# EasyEDA Pro project USBHUB.epro

# Schematic USBUHB2.0
Board Name: Board1; Create Date: 2025-05-13; Page Name: P1; Project Name: expertlearning-2; Schematic Name: USBUHB2.0; Update Date: 2025-05-14; Company: 东北林业大学; Drawed: runb0t; Page Size: A4; Version: V1.0
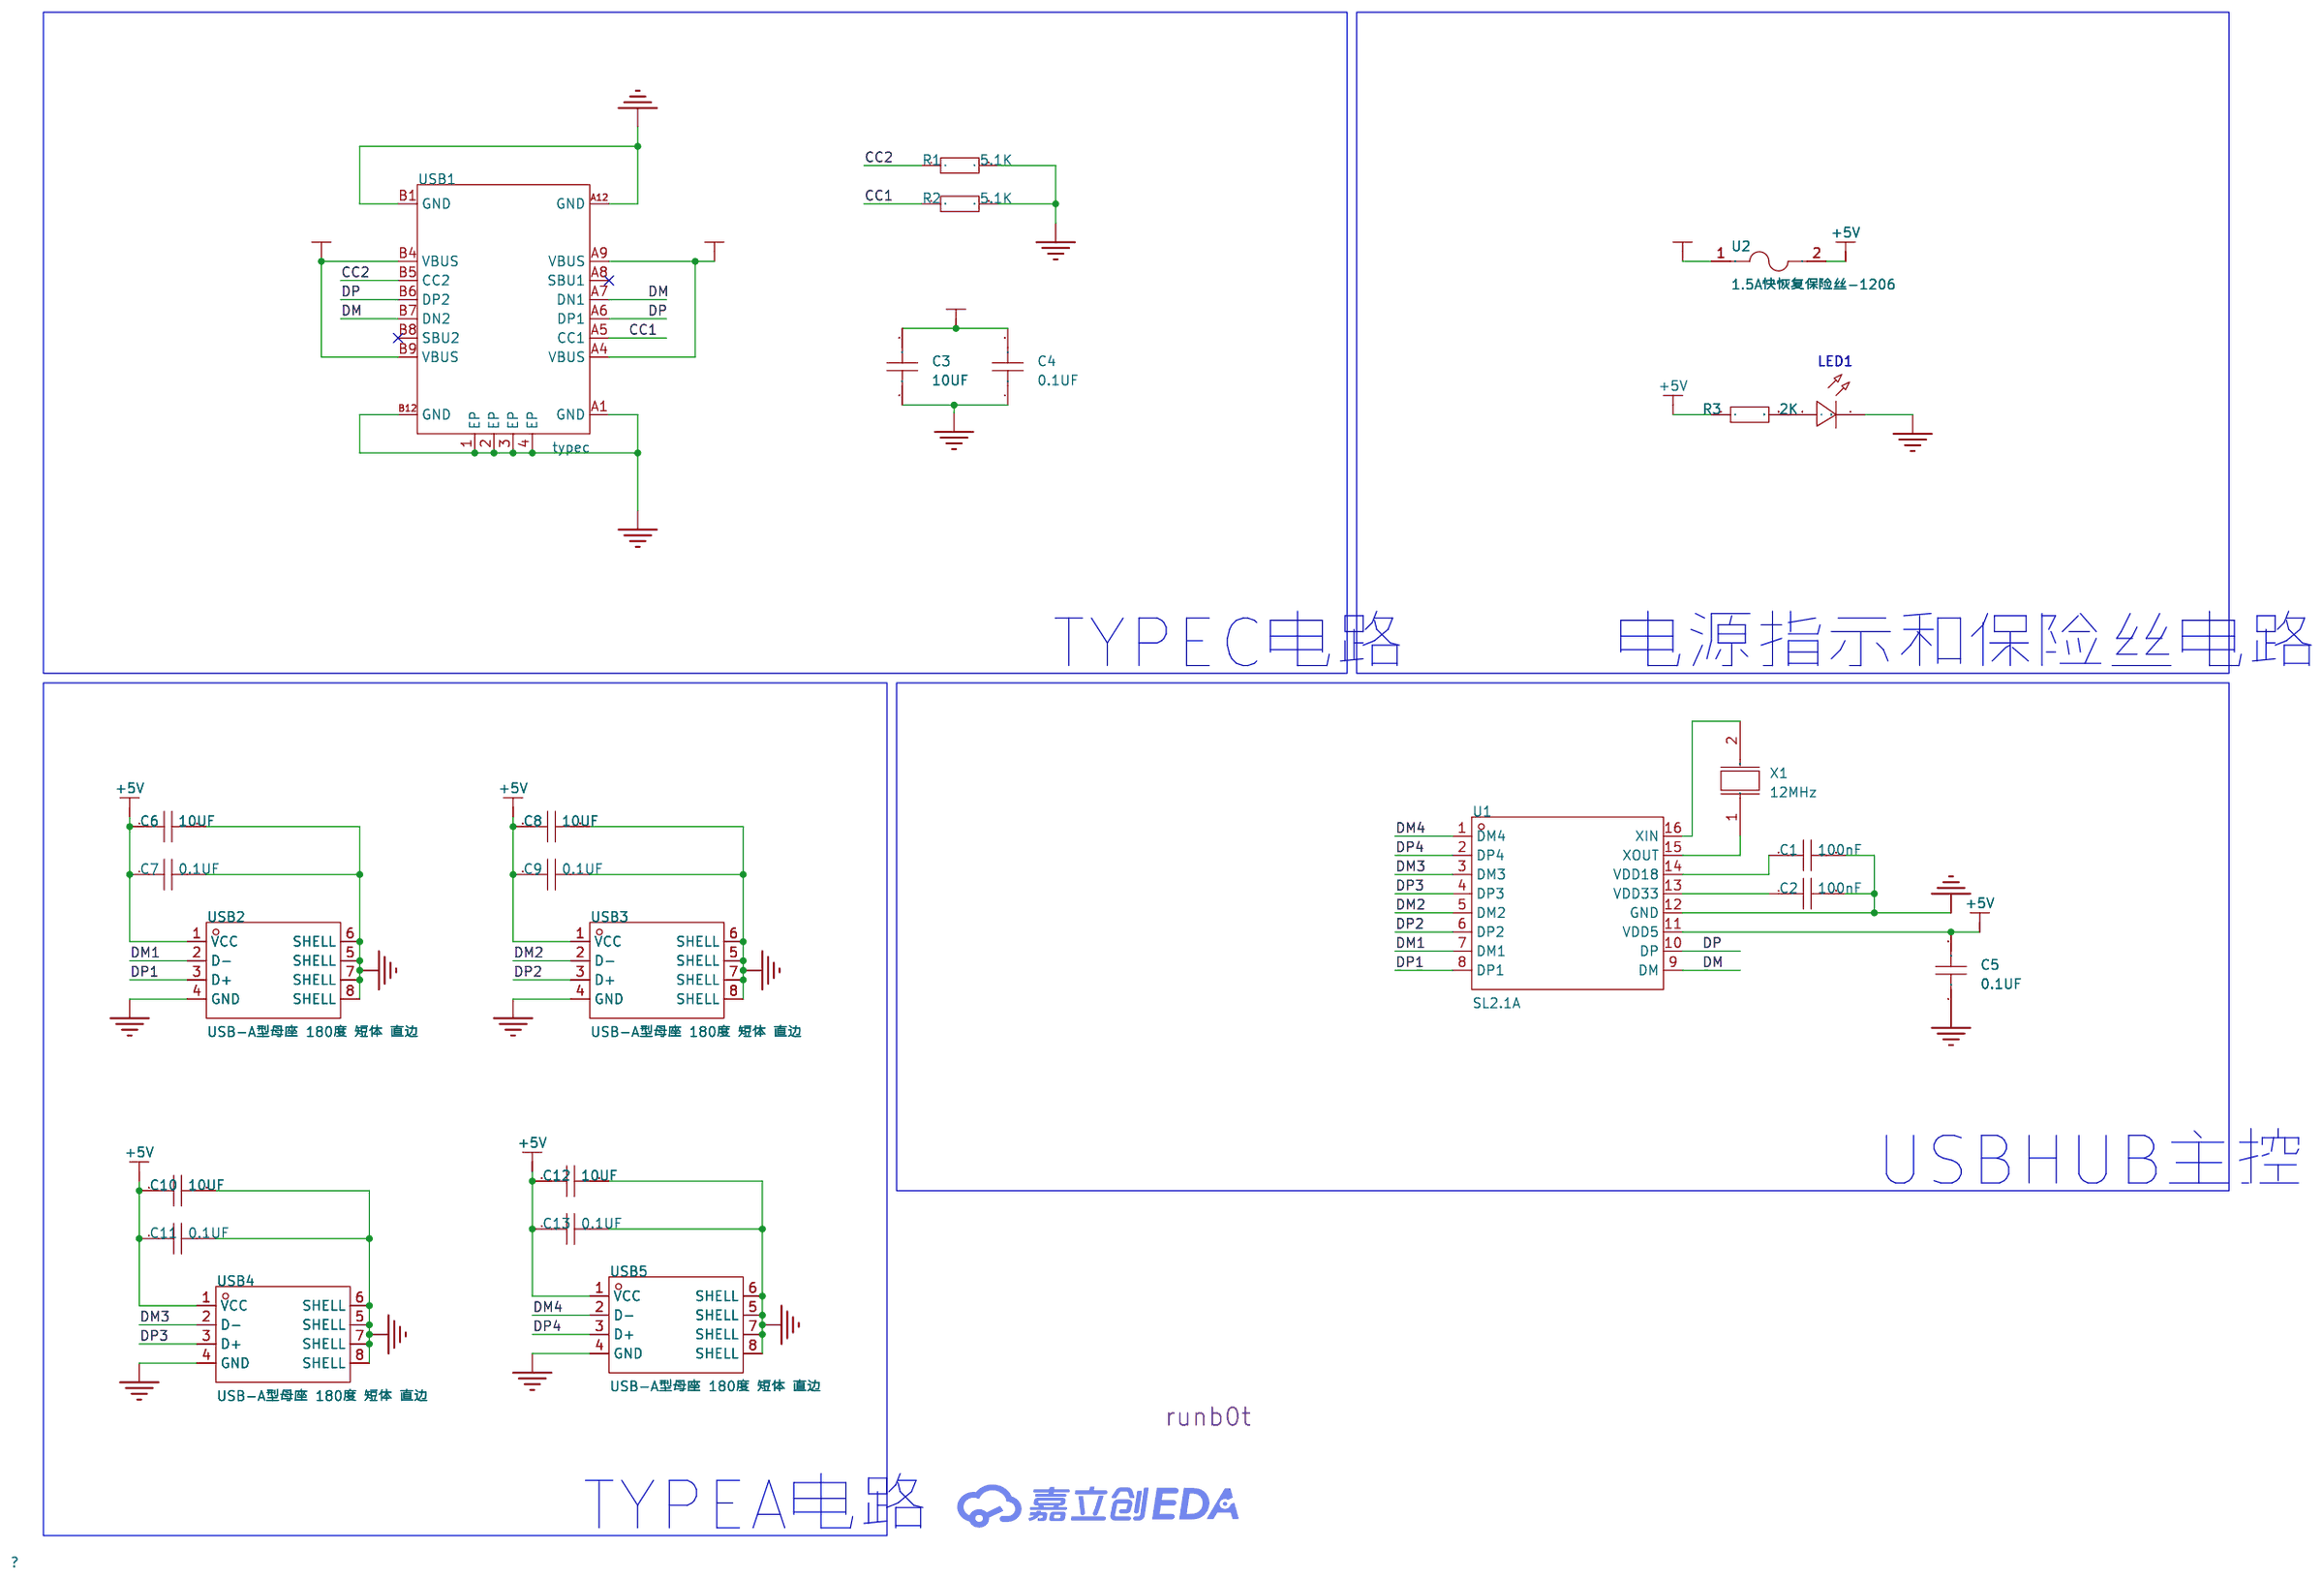
[diagram p0: schematic sheet]

## Parts
C1  100nF  [C0805]
C2  100nF  [C0805]
C3  10UF  [C0805]
C4  0.1UF  [C0805]
C5  0.1UF  [C0805]
C6  10UF  [C0805]
C7  0.1UF  [C0805]
C8  10UF  [C0805]
C9  0.1UF  [C0805]
C10  10UF  [C0805]
C11  0.1UF  [C0805]
C12  10UF  [C0805]
C13  0.1UF  [C0805]
LED1  -  [LED_0805]
R1  5.1K  [R0805]
R2  5.1K  [R0805]
R3  2K  [R0805]
U1  SL2.1A  [SOP-16_L10.0-W3.9-P1.27-LS6.0-BL]
U2  1.5A快恢复保险丝-1206  [F1206]
USB1  typec  [USB-C-SMD_KH-TYPE-C-16P]
USB2  USB-A型母座 180度 短体 直边  [USB-A-SMD_WT_C9900004571]
USB3  USB-A型母座 180度 短体 直边  [USB-A-SMD_WT_C9900004571]
USB4  USB-A型母座 180度 短体 直边  [USB-A-SMD_WT_C9900004571]
USB5  USB-A型母座 180度 短体 直边  [USB-A-SMD_WT_C9900004571]
X1  12MHz  [CRYSTAL-SMD_L5.0-W3.2-1-A]

## Library data of the parts
C1-C13 = CAP_0805: Supplier Footprint: 0805
LED1 = LED_0805-G: Supplier Footprint: 0805
R1-R3 = Res_0805: Supplier Footprint: 0805
U1 = SL2.1A: SL2.1A是一颗高集成度,高性能,低功耗的USB2.0集线器主控芯片，支持USB2.0高速(480MHz),全速(12MHz)和低速模式(1.5MHz)，内置12MHz晶体振荡器。; LCSC Part Name: USB2.0高速4端口HUB控制器; Supplier Part: C192893; Manufacturer: CoreChips(和芯润德); Supplier Footprint: SOP-16; JLCPCB Part Class: 扩展库; Datasheet: https://atta.szlcsc.com/upload/public/pdf/source/20180522/C192893_624110D24898D57AAC785E3DF98EA862.pdf; Supplier: LCSC
U2 = 1.5A快恢复保险丝-1206: Supplier Part: C9900012139; JLCPCB Part Class: 扩展库; Supplier: LCSC
USB1 = typec: Supplier Part: C9900016956; Supplier Footprint: typec 12p; JLCPCB Part Class: 扩展库; Supplier: LCSC
USB2-USB5 = USB-A型母座 180度 短体 直边: Supplier Part: C9900004571; Supplier Footprint: SMD; JLCPCB Part Class: 扩展库; Supplier: LCSC
X1 = G5312000202090: 晶振类型:贴片晶振;频率:12MHz;常温频差:±20ppm;外接负载电容:20pF;; LCSC Part Name: 12MHz ±20ppm 20pF; Supplier Part: C479171; Manufacturer: JGHC(晶光华); Supplier Footprint: SMD5032; JLCPCB Part Class: 扩展库; Datasheet: https://atta.szlcsc.com/upload/public/pdf/source/20200102/C479172_02E461FA3A6D6D7CC97069C24BD4D6B6.pdf; Supplier: LCSC; Crystal Type: 贴片晶振; Normal temperature Frequency Tolerance: ±20ppm; External load capacitor: 20pF; Equivalent Series Resistance (ESR): 90Ω; Operating Temperature: -40℃~+85℃

## Nets
+5V: C5.2 C6.1 C7.1 C8.1 C9.1 C10.1 C11.1 C12.1 C13.1 R3.1 U1.11(VDD5) U2.2 USB2.1(VCC) USB3.1(VCC) USB4.1(VCC) USB5.1(VCC)
GND: C1.2 C2.2 C3.1 C4.1 C5.1 C6.2 C7.2 C8.2 C9.2 C10.2 C11.2 C12.2 C13.2 LED1.1(C) R1.2 R2.2 U1.12(GND) USB1.1(EP) USB1.2(EP) USB1.3(EP) USB1.4(EP) USB1.A1(GND) USB1.A12(GND) USB1.B1(GND) USB1.B12(GND) USB2.4(GND) USB2.5(SHELL) USB2.6(SHELL) USB2.7(SHELL) USB2.8(SHELL) USB3.4(GND) USB3.5(SHELL) USB3.6(SHELL) USB3.7(SHELL) USB3.8(SHELL) USB4.4(GND) USB4.5(SHELL) USB4.6(SHELL) USB4.7(SHELL) USB4.8(SHELL) USB5.4(GND) USB5.5(SHELL) USB5.6(SHELL) USB5.7(SHELL) USB5.8(SHELL)
VCC+5V: C3.2 C4.2 U2.1 USB1.A4(VBUS) USB1.A9(VBUS) USB1.B4(VBUS) USB1.B9(VBUS)
CC1: R2.1 USB1.A5(CC1)
CC2: R1.1 USB1.B5(CC2)
DM: U1.9(DM) USB1.A7(DN1) USB1.B7(DN2)
DM1: U1.7(DM1) USB2.2(D-)
DM2: U1.5(DM2) USB3.2(D-)
DM3: U1.3(DM3) USB4.2(D-)
DM4: U1.1(DM4) USB5.2(D-)
DP: U1.10(DP) USB1.A6(DP1) USB1.B6(DP2)
DP1: U1.8(DP1) USB2.3(D+)
DP2: U1.6(DP2) USB3.3(D+)
DP3: U1.4(DP3) USB4.3(D+)
DP4: U1.2(DP4) USB5.3(D+)
$1N963: C2.1 U1.13(VDD33)
$1N967: C1.1 U1.14(VDD18)
$1N971: U1.15(XOUT) X1.1
$1N975: U1.16(XIN) X1.2
$1N2854: LED1.2(A) R3.2

Not connected (* = marked no-connect by the designer): USB1 A8(SBU1)* B8(SBU2)*

## Notes on the sheet
- TYPEC电路
- 电源指示和保险丝电路
- USBHUB主控
- TYPEA电路

# Board USBHUB
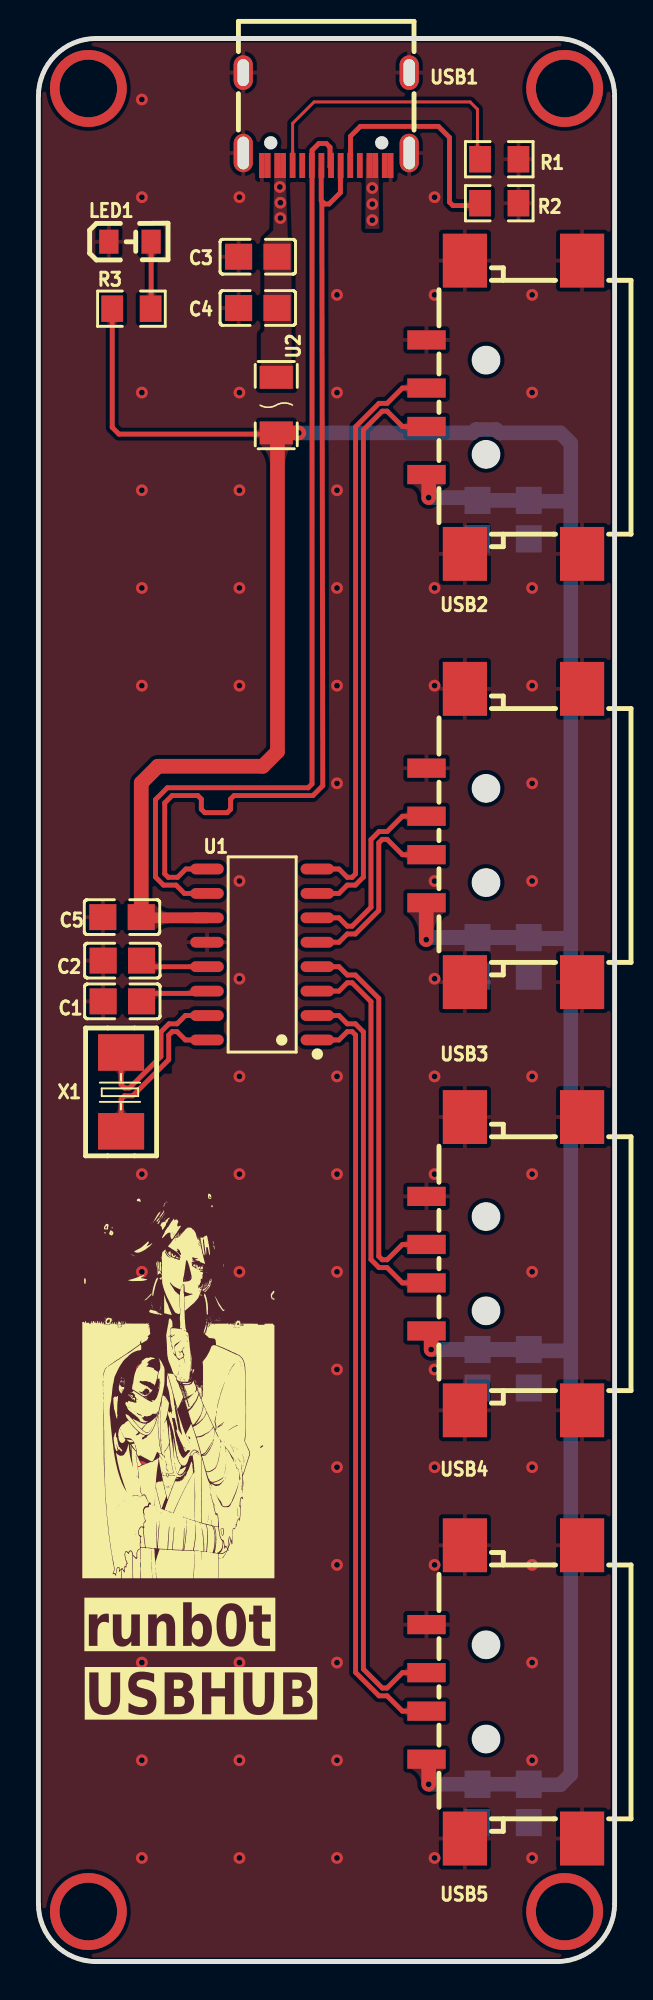
[diagram p1: board, top side]
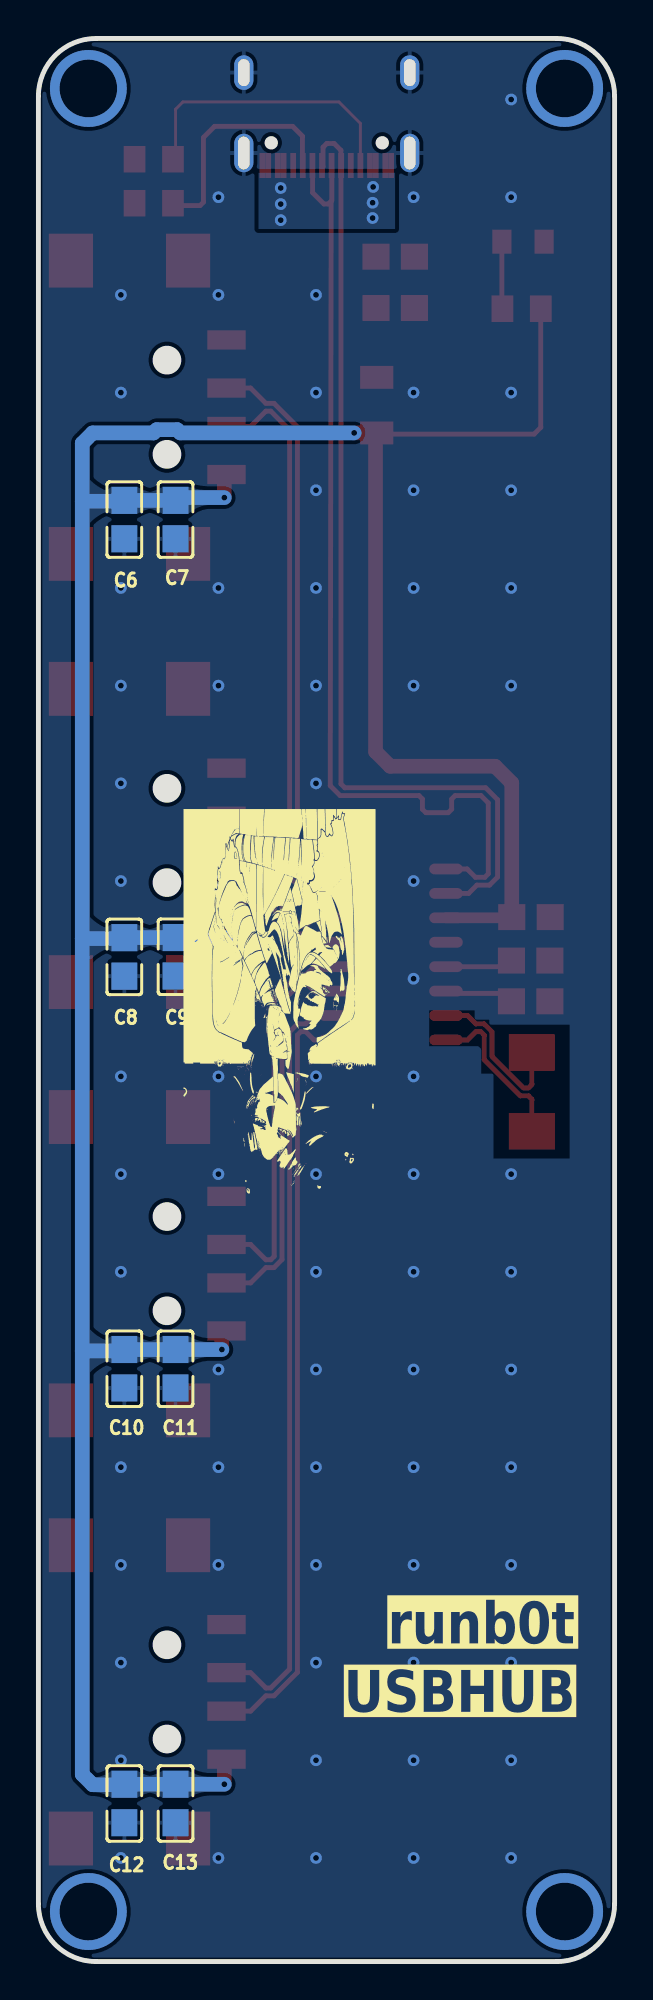
[diagram p2: board, bottom side, seen from below]

Outline 30 x 100 mm; copper layers: Top Layer, Bottom Layer. Coordinates in mm from the lower left corner of the outline.
Outline path: 0,97 0,3 arc(0.88,0.88) 3,0 27,0 arc(29.12,0.88) 30,3 30,97 arc(29.12,99.12) 27,100 3,100 arc(0.88,99.12) 0,97
Stack: Top Layer 0.035mm / Dielectric1 1.51mm FR4 er 4.5 / Bottom Layer 0.035mm

## Design rules (mm)
net DM4: DP4
net DP4: DP4
net DM3: DP3
net DP3: DP3
net DM2: DP2
net DP2: DP2
net DM1: DP1
net DP1: DP1
net $1N975: DP6
net $1N971: DP6
net DP: DP5
net DM: DP5
template: 自定义配置
spacing copperThickness1oz (default): track to track 0.102, other pairs 0.152 to 0.3
spacing copperThickness2oz: track to track 0.203, other pairs 0.152 to 0.3
track width copperThickness1oz (default): min 0.127, default 0.254, max 2.54
track width copperThickness2oz: min 0.203, default 0.254, max 2.54
differential pair differentialPair (default): width min 0.127, default 0.254, max 2.54; gap min 0.152, default 0.152
via viaSize (default): diameter min 0.5, default 0.61, max 10; hole min 0.3, default 0.305, max 6.3

## Placement (name value [footprint] x y rotation side)
C1  100nF  [C0805]  4.37 49.93 180 top
C2  100nF  [C0805]  4.37 52.05 180 top
C3  10UF  [C0805]  11.42 88.65 0 top
C4  0.1UF  [C0805]  11.42 85.98 0 top
C5  0.1UF  [C0805]  4.35 54.31 0 top
C6  10UF  [C0805]  25.53 74.98 270 bottom
C7  0.1UF  [C0805]  22.86 74.98 270 bottom
C8  10UF  [C0805]  25.53 52.24 270 bottom
C9  0.1UF  [C0805]  22.86 52.25 270 bottom
C10  10UF  [C0805]  25.53 30.82 270 bottom
C11  0.1UF  [C0805]  22.86 30.82 270 bottom
C12  10UF  [C0805]  25.53 8.22 270 bottom
C13  0.1UF  [C0805]  22.86 8.22 270 bottom
LED1  -  [LED_0805]  4.82 89.43 0 top
R1  5.1K  [R0805]  24 93.72 0 top
R2  5.1K  [R0805]  24 91.43 0 top
R3  2K  [R0805]  4.84 85.95 0 top
U1  SL2.1A  [SOP-16_L10.0-W3.9-P1.27-LS6.0-BL]  11.65 52.37 90 top
U2  1.5A快恢复保险丝-1206  [F1206]  12.38 80.93 270 top
USB1  typec  [USB-C-SMD_KH-TYPE-C-16P]  14.99 95.81 180 top
USB2  USB-A型母座 180度 短体 直边  [USB-A-SMD_WT_C9900004571]  24.26 80.82 90 top
USB3  USB-A型母座 180度 短体 直边  [USB-A-SMD_WT_C9900004571]  24.26 58.56 90 top
USB4  USB-A型母座 180度 短体 直边  [USB-A-SMD_WT_C9900004571]  24.26 36.29 90 top
USB5  USB-A型母座 180度 短体 直边  [USB-A-SMD_WT_C9900004571]  24.26 14.02 90 top
X1  12MHz  [CRYSTAL-SMD_L5.0-W3.2-1-A]  4.31 45.22 270 top

## Footprints (pads in the part's own frame, mm; a bottom-side part is the same pattern mirrored in y, then rotated)
C0805
  rect 1.41x1.35 smd: 1(-1,0) 2(1,0)
CRYSTAL-SMD_L5.0-W3.2-1-A
  rect 1.9x2.4 smd: 1(-2.05,0) 2(2.05,0)
F1206
  rect 1.19x1.728 smd: 1(-1.445,0) 2(1.445,0)
LED_0805
  rect 1x1.25 smd: 1(-1.15,0.005) 2(1.05,0.005)
R0805
  rect 1.133x1.377 smd: 1(-1,0) 2(1,0)
SOP-16_L10.0-W3.9-P1.27-LS6.0-BL
  oval 0.56x1.745 smd: 1(-4.445,-2.873) 2(-3.175,-2.873) 3(-1.905,-2.873) 4(-0.635,-2.873) 5(0.635,-2.873) 6(1.905,-2.873) 7(3.175,-2.873) 8(4.445,-2.873) 9(4.445,2.873) 10(3.175,2.873) 11(1.905,2.873) 12(0.635,2.873) 13(-0.635,2.873) 14(-1.905,2.873) 15(-3.175,2.873) 16(-4.445,2.873)
USB-A-SMD_WT_C9900004571
  rect 1x2 smd: 1(-3.5,4.05) 2(-1,4.05) 3(1,4.05) 4(3.5,4.05)
  rect 2.8x2.3 smd: 5(-7.625,2.05) 6(-7.625,-4.05) 7(7.625,-4.05) 8(7.625,2.05)
USB-C-SMD_KH-TYPE-C-16P
  oval 1x2 hole 0.6x1.7: 1(-4.32,1.765) 2(4.32,1.765)
  oval 1x1.8 hole 0.6x1.4: 3(-4.32,-2.415) 4(4.32,-2.415)
  rect 0.3x1.3 smd: A1(-3.35,2.415) A4(-2.55,2.415) A5(-1.25,2.415) A6(-0.25,2.415) A7(0.25,2.415) A8(1.25,2.415) A9(2.55,2.415) A12(3.35,2.415) B1(3.05,2.415) B4(2.25,2.415) B5(1.75,2.415) B6(0.75,2.415) B7(-0.75,2.415) B8(-1.75,2.415) B9(-2.25,2.415) B12(-3.05,2.415)

## Nets
As in the schematic.

Pads without a net: USB1 A8 B8

## Via types
v1: diameter 4, hole 3, Top Layer to Bottom Layer, 4 vias
v2: diameter 0.61, hole 0.305, Top Layer to Bottom Layer, 82 vias

## Routing (per net, layer and track width the routed paths; a pad name or vN(x,y) marks a point on that pad's centre or on a via; arc(x,y) is an arc through that point)
+5V: length 170
  Top Layer w0.254: R3.1 3.84,79.77 4.19,79.43 12.32,79.43
  Top Layer w0.559: C5.2 5.39,54.27 U1.11
  Top Layer w0.762: USB2.1 20.32,77.21 v2(20.32,76.12) ; C5.2 5.35,61.28 6.22,62.15 11.68,62.15 12.45,62.92 12.45,79.3 12.32,79.43 ; v2(20.45,31.82) 20.45,32.55 USB4.1 ; v2(20.19,53.14) 20.19,55.04 USB3.1 ; v2(20.32,9.22) 20.32,10.41 USB5.1 ; U2.2 v2(13.56,79.49)
  Bottom Layer w0.762: v2(13.56,79.49) 22.61,79.49 22.78,79.66 23.84,79.66 24.01,79.49 27.18,79.49 27.72,78.95 27.72,75.93 ; v2(20.32,76.12) 22.72,76.12 C7.1 C6.1 25.57,75.93 27.72,75.93 ; 27.72,31.75 25.6,31.75 C10.1 C11.1 v2(20.45,31.82) ; 27.72,31.75 27.72,9.73 27.18,9.19 25.55,9.19 C12.1 C13.1 v2(20.32,9.22) ; 27.72,31.75 27.72,53.19 ; 27.72,53.19 25.57,53.19 C8.1 25.52,53.25 C9.1 20.3,53.25 v2(20.19,53.14) ; 27.72,53.19 27.72,75.93
GND:
  vias: v2(5.39,96.83) v2(5.39,91.75) v2(5.39,81.59) v2(5.39,76.51) v2(5.39,71.43) v2(5.39,66.35) v2(5.39,40.95) v2(5.39,35.87) v2(5.39,30.79) v2(5.39,25.71) v2(5.39,20.63) v2(5.39,15.55) v2(5.39,10.47) v2(5.39,5.39) v2(10.47,91.75) v2(10.47,81.59) v2(10.47,76.51) v2(10.47,71.43) v2(10.47,66.35) v2(10.47,56.19) v2(10.47,51.11) v2(10.47,46.03) v2(10.47,40.95) v2(10.47,35.87) v2(10.47,30.79) v2(10.47,25.71) v2(10.47,20.63) v2(10.47,15.55) v2(10.47,10.47) v2(10.47,5.39) v2(15.55,86.67) v2(15.55,81.59) v2(15.55,76.51) v2(15.55,71.43) v2(15.55,66.35) v2(15.55,61.27) v2(15.55,46.03) v2(15.55,40.95) v2(15.55,35.87) v2(15.55,30.79) v2(15.55,25.71) v2(15.55,20.63) v2(15.55,15.55) v2(15.55,10.47) v2(15.55,5.39) v2(20.63,91.75) v2(20.63,86.67) v2(20.63,71.43) v2(20.63,66.35) v2(20.63,56.19) v2(20.63,51.11) v2(20.63,46.03) v2(20.63,40.95) v2(20.63,30.79) v2(20.63,25.71) v2(20.63,20.63) v2(20.63,5.39) v2(25.71,86.67) v2(25.71,81.59) v2(25.71,71.43) v2(25.71,66.35) v2(25.71,61.27) v2(25.71,56.19) v2(25.71,46.03) v2(25.71,40.95) v2(25.71,35.87) v2(25.71,25.71) v2(25.71,20.63) v2(25.71,15.55) v2(25.71,10.47) v2(25.71,5.39)
VCC+5V:
  vias: v2(12.57,92.28) v2(12.6,91.46) v2(12.6,90.66) v2(17.38,92.22) v2(17.38,91.39) v2(17.38,90.55)
(no net):
  vias: v1(2.6,97.4) v1(2.6,2.6) v1(27.4,97.4) v1(27.4,2.6)
CC1: length 12.3
  Top Layer w0.254: R2.1 22.87,91.31 21.58,91.31 21.4,91.49 21.4,94.85 20.83,95.43 16.76,95.43 16.25,94.91 16.25,93.27
CC2: length 15.1
  Top Layer w0.152: USB1.B5 13.24,95.58 14.35,96.7 22.48,96.7 22.86,96.32 22.86,93.86 R1.1
DM: length 50.8
  Top Layer w0.254: 14.76,91.48 14.81,61.15 14.29,60.63 10.19,60.63 10.01,60.45 10.01,59.92 9.83,59.74 8.66,59.74 8.48,59.92 8.48,60.45 8.3,60.63 6.96,60.63 6.58,60.25 6.58,56.56 6.76,56.38 7.24,56.38 7.68,56.81 8.8,56.81 ; 15.72,93.27 15.72,91.98 15.14,91.39 14.9,91.39 14.72,91.57 14.72,93.27
DM1: length 30
  Top Layer w0.254: U1.7 15.65,55.54 16.08,55.97 16.5,55.97 16.92,56.39 16.92,79.64 17.9,80.62 18.16,80.62 18.95,79.82 USB2.2
DM2: length 10.3
  Top Layer w0.254: U1.5 15.65,53 16.08,53.43 16.5,53.43 17.72,54.65 17.72,58.17 17.9,58.35 18.16,58.35 18.95,57.56 20.21,57.56
DM3: length 20.2
  Top Layer w0.254: USB4.2 18.95,35.29 18.16,36.08 17.73,36.08 17.32,36.5 17.32,49.91 16.34,50.89 16.08,50.89 15.65,50.46 U1.3
DM4: length 39.9
  Top Layer w0.254: U1.1 15.65,47.92 16.08,48.35 16.34,48.35 16.51,48.17 16.51,15.04 17.73,13.82 18.16,13.82 18.95,13.02 USB5.2
DP: length 50.8
  Top Layer w0.254: 14.25,93.27 14.25,94.18 14.6,94.54 14.99,94.54 15.18,94.35 15.18,93.34 15.25,93.27 ; 8.85,55.54 7.6,55.54 7.17,55.97 6.51,55.97 6.09,56.39 6.09,60.42 6.71,61.04 14.05,61.04 14.25,61.24 14.25,93.19
DP1: length 30
  Top Layer w0.254: USB2.3 18.95,81.82 18.16,81.03 17.73,81.03 16.51,79.81 16.51,56.56 16.34,56.38 16.08,56.38 15.65,56.81 U1.8
DP2: length 10.3
  Top Layer w0.254: U1.6 15.65,54.27 16.08,53.84 16.34,53.84 17.32,54.82 17.32,58.34 17.73,58.76 18.16,58.76 18.95,59.56 USB3.3
DP3: length 20.2
  Top Layer w0.254: USB4.3 18.95,37.29 18.16,36.49 17.9,36.49 17.72,36.67 17.72,50.08 16.5,51.3 16.08,51.3 15.65,51.73 U1.4
DP4: length 39.9
  Top Layer w0.254: USB5.3 18.95,15.02 18.16,14.22 17.9,14.22 16.92,15.21 16.92,48.34 16.5,48.76 16.08,48.76 15.65,49.19 U1.2
$1N963: length 3.5
  Top Layer w0.254: C2.1 5.69,51.73 U1.13
$1N967: length 3.6
  Top Layer w0.254: U1.14 8.66,50.34 5.78,50.34 C1.1
$1N971: length 8.5
  Top Layer w0.254: X1.1 4.31,45.6 4.49,45.42 4.74,45.42 6.38,47.06 6.38,48.34 6.8,48.76 7.22,48.76 7.65,49.19 U1.15
$1N975: length 8.5
  Top Layer w0.254: U1.16 7.65,47.92 7.22,48.35 6.97,48.35 6.79,48.17 6.79,46.9 4.91,45.02 4.49,45.02 4.31,44.84 X1.2
$1N2854: length 3.5
  Top Layer w0.254: R3.2 5.87,85.97 LED1.2

## Copper pours and planes (outline as drawn; the poured copper is in the pictures)
GND on Top Layer: -4.83,103.56 35.56,103.56 35.56,-4.65 -4.83,-4.65
GND on Bottom Layer: -9.53,108.76 43.94,108.76 43.94,-10.24 -9.53,-10.24
VCC+5V on Top Layer: 11.58,93.91 13.28,93.91 13.28,81.77 11.58,81.77
VCC+5V on Top Layer: 17.02,93.76 17.75,93.76 17.75,90.09 17.02,90.09
VCC+5V on Bottom Layer: 11.43,93.02 18.54,93.02 18.54,90.09 11.43,90.09

Small or netless copper shapes (teardrops, artwork), in the pictures only: 43 on Top Layer, 20 on Bottom Layer

## Text on the board
Bottom Silkscreen Layer: runb0t | USBHUB
Top Silkscreen Layer: runb0t | USBHUB
